# Altium schematic sheet emi_filter_ch0_a.SchDoc: EMI Filter CH0 A
size A4; Date: 2015-10-11; Author: Piotr Kuligowski; Revision: 1-0; SheetNumber: 4; SheetTotal: 8; Model: EM1
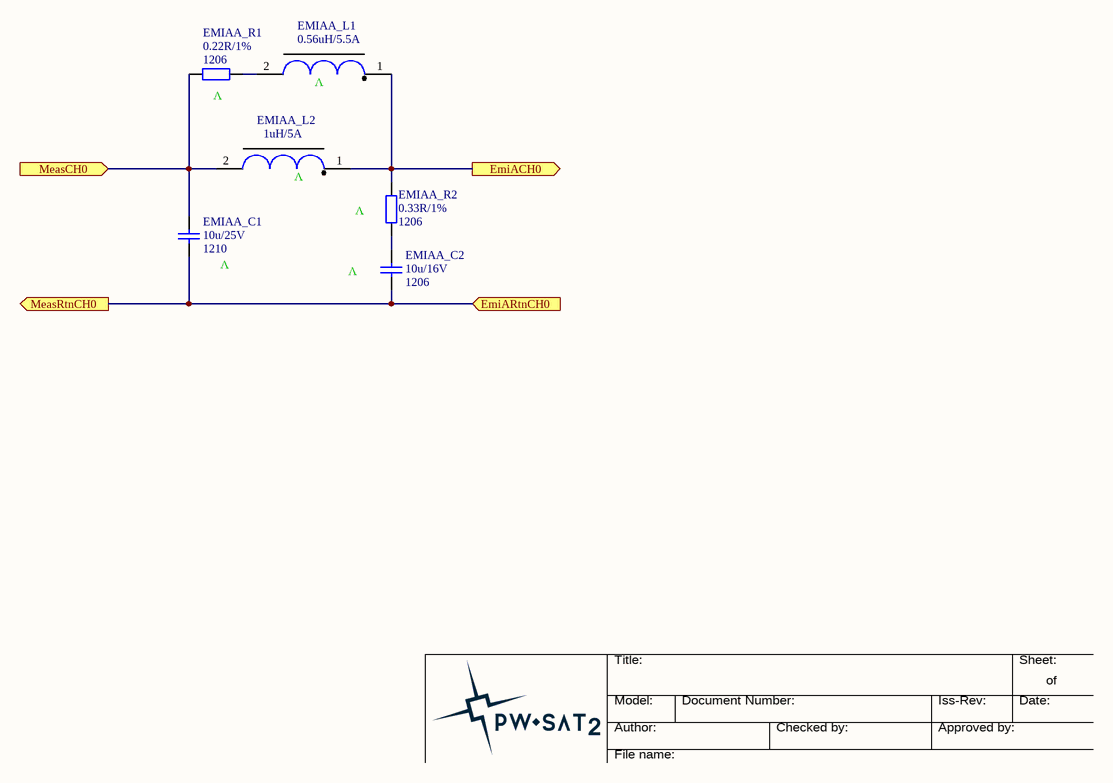
[diagram p0: emi_filter_ch0_a.SchDoc]

## Parts
EMIAA_C1  Package: 1210  [SMD_Capacitor_1210]  (hidden comment: 10u/25V)
EMIAA_C2  Packge: 1206  [SMD_Capacitor_1206]  (hidden comment: 10u/16V)
EMIAA_L1  0.56uH/5.5A  [Vishay_IHLP1212]
EMIAA_L2  1uH/5A  [Vishay_IHLP1212]
EMIAA_R1  Package: 1206  [SMD_Resistor_1206]  (hidden comment: 0.22R/1%)
EMIAA_R2  Package: 1206  [SMD_Resistor_1206]  (hidden comment: 0.33R/1%)

## Ports
EmiACH0 (out), EmiARtnCH0 (in), MeasCH0 (in), MeasRtnCH0 (out)

## Nets
EmiACH0: EMIAA_L1.1 EMIAA_L2.1 EMIAA_R2.2 ; port EmiACH0
EmiARtnCH0: EMIAA_C1.2 EMIAA_C2.2 ; port MeasRtnCH0, port EmiARtnCH0
MeasCH0: EMIAA_C1.1 EMIAA_L2.2 EMIAA_R1.1 ; port MeasCH0
NetEMIAA_C2_1: EMIAA_C2.1 EMIAA_R2.1
NetEMIAA_L1_2: EMIAA_L1.2 EMIAA_R1.2

## Notes on the sheet
- (near EMIAA_L1) V
- (near EMIAA_R1) V
- (near EMIAA_L2) V
- (near EMIAA_R2) V
- (near EMIAA_C1) V
- (near EMIAA_C2) V
- Title:
- Sheet:
- of
- Author:
- Model:
- Document Number:
- Checked by:
- Iss-Rev:
- Approved by:
- Date:
- File name:

## Library data of the parts
EMIAA_C1 = Cer_GCJ32ER71E106KA12L: Ceramic Cap Murata Automotive 10u/25V X7R 1210; Manufacturer: Murata; ManufacturerPartNumber: GCJ32ER71E106KA12L; Value: 10u/25V
EMIAA_C2 = Cer_C1206T106K4RACTU: Ceramic Cap Kemet COTS 10u/16V X7R 1206; ManufacturerPartNumber: C1206T106K4RACTU; Manufacturer: Kemet; Value: 10u/16V
EMIAA_L1 = IHLP1212BZERR56M11: Vishay IHLP1212 Inductor, L=0.56uH, Irise40deg=5.5A, ESR=16mR, SRF=1MHz.; Manufacturer: Vishay; ManufacturerPartNumber: IHLP1212BZERR56M11; Value: 0.56uH/5.5A
EMIAA_L2 = IHLP1212BZER1R0M11: Vishay IHLP1212 Inductor, L=1uH, Irise40deg=5A, ESR=20mR, SRF=1MHz.; Manufacturer: Vishay; ManufacturerPartNumber: IHLP1212BZER1R0M11; Value: 1uH/5A
EMIAA_R1 = ERJ-8BQFR22V: Panasonic Resistor 0.22R 1% 1206 330mW; Manufacturer: Panasonic; ManufacturerPartNumber: ERJ-8BQFR22V; Value: 0.22R/1%
EMIAA_R2 = ERJ-8BQFR33V: Panasonic Resistor 0.33R 1% 1206 330mW; Manufacturer: Panasonic; ManufacturerPartNumber: ERJ-8BQFR33V; Value: 0.33R/1%